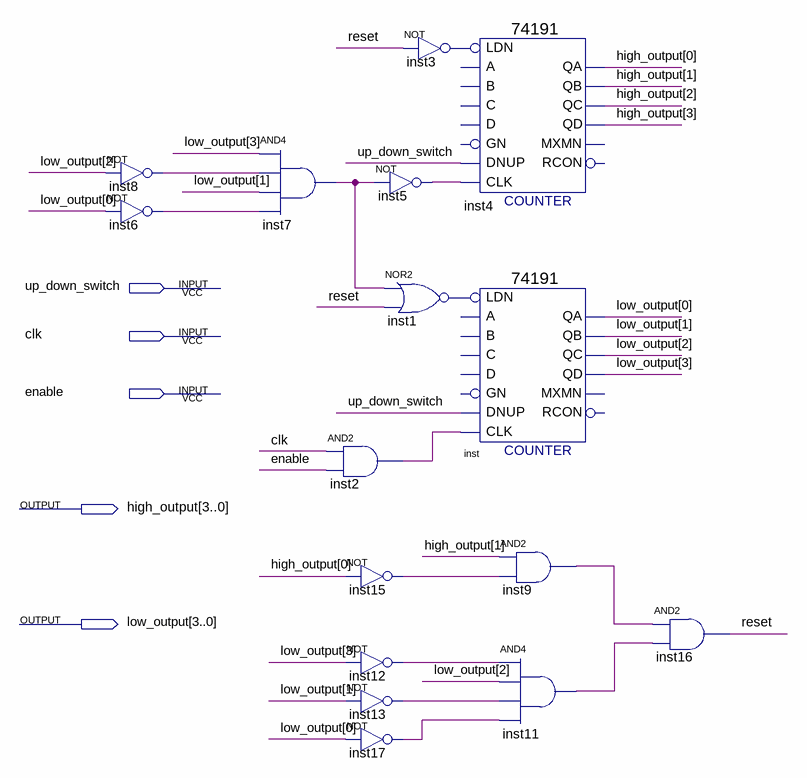
[diagram p0: schematic sheet]
// Quartus schematic counter_24.bdf as structural Verilog: 16 symbols, 5 pins
module counter_24 (
  input  up_down_switch,
  input  clk,
  input  enable,
  output [3:0] high_output,
  output [3:0] low_output
);

  wire inst1_out, inst2_out, inst3_out, inst5_out, inst6_out, inst7_out, inst8_out, inst9_out, inst11_out,
       inst12_out, inst13_out, inst15_out, inst17_out, reset;

  not inst8 (inst8_out, low_output[2]);
  not inst6 (inst6_out, low_output[0]);
  and inst7 (inst7_out, low_output[3], inst8_out, low_output[1], inst6_out);
  and inst2 (inst2_out, clk, enable);
  not inst15 (inst15_out, high_output[0]);
  not inst12 (inst12_out, low_output[3]);
  not inst13 (inst13_out, low_output[1]);
  not inst17 (inst17_out, low_output[0]);
  not inst3 (inst3_out, reset);
  not inst5 (inst5_out, inst7_out);
  nor inst1 (inst1_out, inst7_out, reset);
  \74191  inst4 (
    .LDN(inst3_out), .CLK(inst5_out), .DNUP(up_down_switch), .QA(high_output[0]), .QB(high_output[1]),
    .QD(high_output[3]), .QC(high_output[2]));  // open: D, C, B, A, GN, RCON, MXMN
  \74191  inst (
    .LDN(inst1_out), .CLK(inst2_out), .DNUP(up_down_switch), .QA(low_output[0]), .QB(low_output[1]),
    .QD(low_output[3]), .QC(low_output[2]));  // open: D, C, B, A, GN, RCON, MXMN
  and inst9 (inst9_out, high_output[1], inst15_out);
  and inst11 (inst11_out, inst12_out, low_output[2], inst13_out, inst17_out);
  and inst16 (reset, inst9_out, inst11_out);
endmodule
